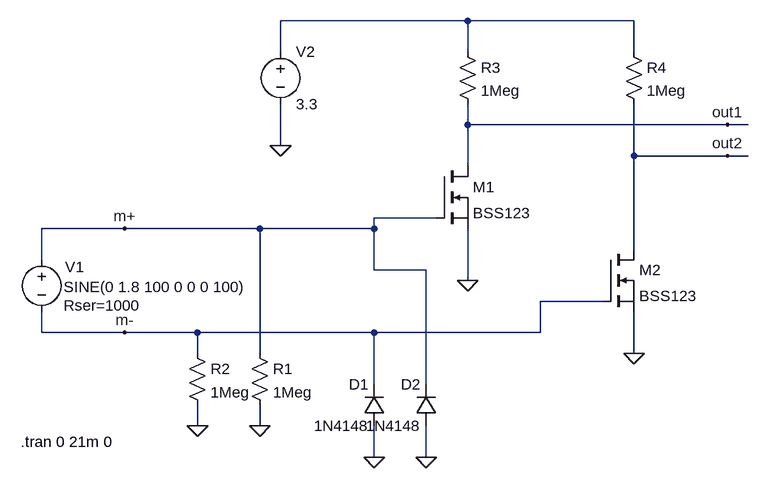
[diagram p0: schematic backdrive.asc]
backdrive.asc, the LTspice schematic file:
Version 4
SHEET 1 940 680
WIRE 496 -352 208 -352
WIRE 752 -352 496 -352
WIRE 208 -304 208 -352
WIRE 496 -304 496 -352
WIRE 752 -304 752 -352
WIRE 496 -192 496 -224
WIRE 896 -192 496 -192
WIRE 928 -192 896 -192
WIRE 208 -160 208 -224
WIRE 752 -144 752 -224
WIRE 896 -144 752 -144
WIRE 928 -144 896 -144
WIRE 496 -128 496 -192
WIRE 448 -48 352 -48
WIRE -32 -32 -160 -32
WIRE 176 -32 -32 -32
WIRE 352 -32 352 -48
WIRE 352 -32 176 -32
WIRE 752 0 752 -144
WIRE -160 16 -160 -32
WIRE 352 32 352 -32
WIRE 432 32 352 32
WIRE 496 48 496 -32
WIRE 704 80 608 80
WIRE -160 128 -160 96
WIRE -32 128 -160 128
WIRE 80 128 -32 128
WIRE 352 128 80 128
WIRE 608 128 608 80
WIRE 608 128 352 128
WIRE 80 160 80 128
WIRE 176 160 176 -32
WIRE 752 160 752 96
WIRE 352 208 352 128
WIRE 432 208 432 32
WIRE 80 272 80 240
WIRE 176 272 176 240
WIRE 352 320 352 272
WIRE 432 320 432 272
FLAG 176 272 0
FLAG 80 272 0
FLAG 208 -160 0
FLAG 752 160 0
FLAG 496 48 0
FLAG 896 -192 out1
FLAG 896 -144 out2
FLAG -32 -32 m+
FLAG -32 128 m-
FLAG 352 320 0
FLAG 432 320 0
SYMBOL res 160 144 R0
SYMATTR InstName R1
SYMATTR Value 1Meg
SYMBOL res 64 144 R0
SYMATTR InstName R2
SYMATTR Value 1Meg
SYMBOL voltage -160 0 R0
WINDOW 0 36 27 Left 2
WINDOW 3 34 58 Left 2
WINDOW 123 0 0 Left 0
WINDOW 39 34 86 Left 2
SYMATTR InstName V1
SYMATTR Value SINE(0 1.8 100 0 0 0 100)
SYMATTR SpiceLine Rser=1000
SYMBOL nmos 448 -128 R0
SYMATTR InstName M1
SYMATTR Value BSS123
SYMBOL nmos 704 0 R0
SYMATTR InstName M2
SYMATTR Value BSS123
SYMBOL res 480 -320 R0
SYMATTR InstName R3
SYMATTR Value 1Meg
SYMBOL res 736 -320 R0
SYMATTR InstName R4
SYMATTR Value 1Meg
SYMBOL voltage 208 -320 R0
WINDOW 123 0 0 Left 0
WINDOW 39 0 0 Left 0
SYMATTR InstName V2
SYMATTR Value 3.3
SYMBOL diode 368 272 R180
WINDOW 0 24 64 Left 2
WINDOW 3 24 0 Left 2
SYMATTR InstName D1
SYMATTR Value 1N4148
SYMBOL diode 448 272 R180
WINDOW 0 24 64 Left 2
WINDOW 3 24 0 Left 2
SYMATTR InstName D2
SYMATTR Value 1N4148
TEXT -192 296 Left 2 !.tran 0 21m 0

The netlist it stands for:
* backdrive.asc
R1 m+ 0 1Meg
R2 m- 0 1Meg
V1 m+ m- SINE(0 1.8 100 0 0 0 100) Rser=1000
M1 out1 m+ 0 0 BSS123
M2 out2 m- 0 0 BSS123
R3 N001 out1 1Meg
R4 N001 out2 1Meg
V2 N001 0 3.3
D1 0 m- 1N4148
D2 0 m+ 1N4148
.model D D
.lib standard.dio
.model NMOS NMOS
.model PMOS PMOS
.lib standard.mos
.tran 0 21m 0
.backanno
.end